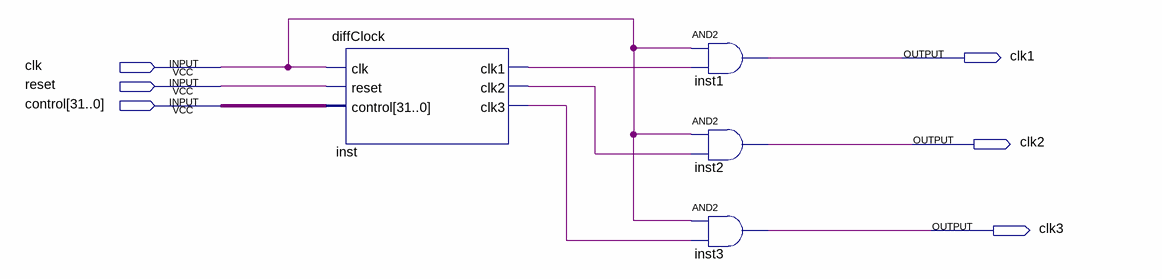
[diagram p0: schematic sheet]
// Quartus schematic diffClockComplete.bdf as structural Verilog: 4 symbols, 6 pins
module diffClockComplete (
  input  clk,
  input  reset,
  input  [31:0] control,
  output clk1,
  output clk2,
  output clk3
);

  wire inst_clk1, inst_clk2, inst_clk3;

  diffClock inst (.clk(clk), .reset(reset), .control(control), .clk1(inst_clk1), .clk2(inst_clk2), .clk3(inst_clk3));
  and inst1 (clk1, clk, inst_clk1);
  and inst2 (clk2, clk, inst_clk2);
  and inst3 (clk3, clk, inst_clk3);
endmodule
